# Altium project LTC_4CH.PrjPcb
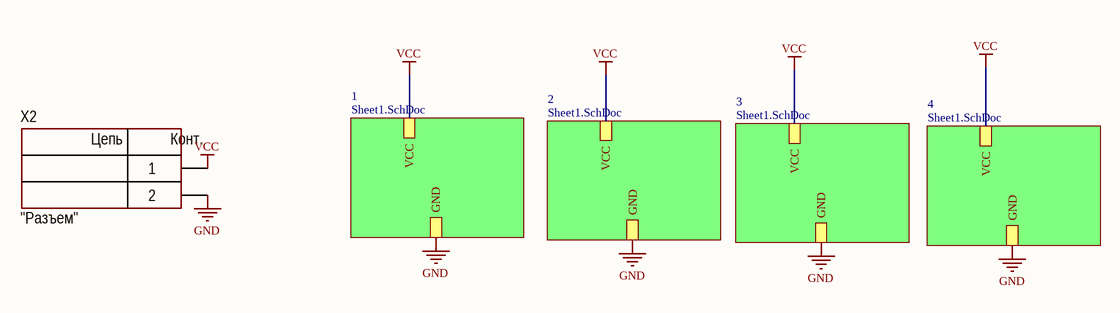
[diagram p0: Sheet2.SchDoc]
2 sheets, 57 parts. Net scope: hierarchical (ports join the sheet entries above them; power ports are global).
Board file: PCB1.PcbDoc
Sheets:
  Sheet2.SchDoc
    1 = Sheet1.SchDoc
    2 = Sheet1.SchDoc
    3 = Sheet1.SchDoc
    4 = Sheet1.SchDoc

## Sheet Sheet2.SchDoc
size 420 x 297 mm; Address1: Address1; Address2: Address2; Address3: Address3; Address4: Address4; DocumentNumber: АБВГ.123456.001 Э3; SheetNumber: 1; Scale: 1:1; DocumentType: Схема электрическая принципиальная; FirstReferrence: АБВГ.123456.001

### Parts
X2  CommentText: "Разъем"  [CON: KF301-5.0-2P]

### Sub-sheets
1 = Sheet1.SchDoc: GND, VCC
2 = Sheet1.SchDoc: GND, VCC
3 = Sheet1.SchDoc: GND, VCC
4 = Sheet1.SchDoc: GND, VCC

### Nets
GND: X2.2 ; sheet 1/GND, sheet 2/GND, sheet 3/GND, sheet 4/GND
VCC: X2.1 ; sheet 1/VCC, sheet 2/VCC, sheet 3/VCC, sheet 4/VCC

### Notes on the sheet
- Перв. примен.
- Справ. №
- Подп. и дата
- Инв. № дубл.
- Взам. инв. №
- Разраб.
- Изм.
- Лист
- № докум.
- Подп.
- Дата
- Лит.
- Масса
- Масштаб
- Пров.
- Т.контр.
- Листов
- Инв. № подл.
- Утв.
- Н.контр.
- 2.106-A3
- Копировал
- Формат А3
- (in symbol Connector_terminal_2pin) Цепь; Конт.

### Library data of the parts
X2 = Connector_terminal_2pin: Manufacturer: Degson; ValueManufacturerPartNumber: Terminal connector, 2pin, 3.5mm, 300VAC, 10A; PartNumber: DG350-3.5-02P-14; TypeConnector: Terminal connector; VoltageMax: 300VAC; Pitch: 3.5mm; CurrentMax: 10A; Multichannel: 2pin; HelpURL: https://www.chipdip.ru/product/dg350-3.5-02p-12

## Sheet Sheet1.SchDoc
size 420 x 297 mm; Address1: Address1; Address2: Address2; Address3: Address3; Address4: Address4; DocumentNumber: АБВГ.123456.001 Э3; SheetNumber: 1; Scale: 1:1; DocumentType: Схема электрическая принципиальная; FirstReferrence: АБВГ.123456.001
Used 4 times, as channels 1, 2, 3, 4. Parts and nets are listed once, with the designators drawn on the sheet.
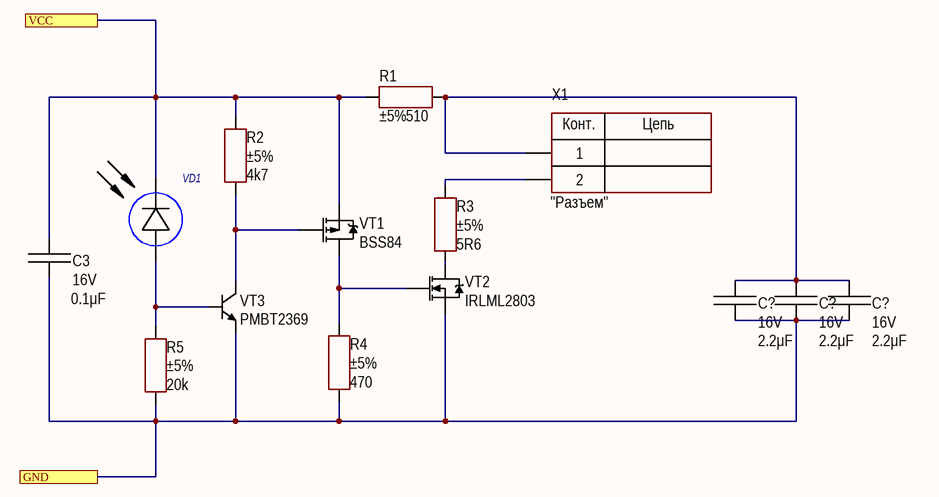
[diagram p1: Sheet1.SchDoc]

### Parts
(Parts that share a designator on the sheet are numbered #1, #2 ... from top to bottom, then left to right.)
C3  value 0.1μF  Voltage: 16V  [CAP: 0805]
C?#1  value 2.2μF  Voltage: 16V  [CAP: 1206]
C?#2  value 2.2μF  Voltage: 16V  [CAP: 1206]
C?#3  value 2.2μF  Voltage: 16V  [CAP: 1206]
R1  value 510  Tolerance: ±5%  [RES: 0805]
R2  value 4k7  Tolerance: ±5%  [RES: 0805]
R3  value 5R6  Tolerance: ±5%  [RES: 1206]
R4  value 470  Tolerance: ±5%  [RES: 0805]
R5  value 20k  Tolerance: ±5%  [RES: 0805]
VD1  SHF250  [LED: SFH757]  (value not drawn)
VT1  PartNumber: BSS84  [SOT23]
VT2  PartNumber: IRLML2803  [SOT23]
VT3  PartNumber: PMBT2369  [SOT23]
X1  CommentText: "Разъем"  [CON: KF301-5.0-2P]

### Ports
GND, VCC

### Nets
GND: C3.1 C?#1.1 C?#2.1 C?#3.1 R4.1 R5.1 VT2.2(S) VT3.2(E) ; port GND
VCC: C3.2 R1.2 R2.2 VD1.2(C) VT1.2(S) ; port VCC
NetC?#1_2: C?#1.2 C?#2.2 C?#3.2 R1.1 X1.1
NetR2_1: R2.1 VT1.1(G) VT3.3(C)
NetR3_1: R3.1 VT2.3(D)
NetR3_2: R3.2 X1.2
NetR4_2: R4.2 VT1.3(D) VT2.1(G)
NetR5_2: R5.2 VD1.1(A) VT3.1(B)

### Channels
1: designators C3=C3_1 C?=C?_1#1 C?=C?_1#2 C?=C?_1#3 R1=R1_1 R2=R2_1 R3=R3_1 R4=R4_1 R5=R5_1 VD1=VD1_1 VT1=VT1_1 VT2=VT2_1 VT3=VT3_1 X1=X1_1; ports GND=GND VCC=VCC
2: designators C3=C3_2 C?=C?_2#1 C?=C?_2#2 C?=C?_2#3 R1=R1_2 R2=R2_2 R3=R3_2 R4=R4_2 R5=R5_2 VD1=VD1_2 VT1=VT1_2 VT2=VT2_2 VT3=VT3_2 X1=X1_2; ports GND=GND VCC=VCC
3: designators C3=C3_3 C?=C?_3#1 C?=C?_3#2 C?=C?_3#3 R1=R1_3 R2=R2_3 R3=R3_3 R4=R4_3 R5=R5_3 VD1=VD1_3 VT1=VT1_3 VT2=VT2_3 VT3=VT3_3 X1=X1_3; ports GND=GND VCC=VCC
4: designators C3=C3_4 C?=C?_4#1 C?=C?_4#2 C?=C?_4#3 R1=R1_4 R2=R2_4 R3=R3_4 R4=R4_4 R5=R5_4 VD1=VD1_4 VT1=VT1_4 VT2=VT2_4 VT3=VT3_4 X1=X1_4; ports GND=GND VCC=VCC

### Notes on the sheet
- Перв. примен.
- Справ. №
- Подп. и дата
- Инв. № дубл.
- Взам. инв. №
- Разраб.
- Изм.
- Лист
- № докум.
- Подп.
- Дата
- Лит.
- Масса
- Масштаб
- Пров.
- Т.контр.
- Листов
- Инв. № подл.
- Утв.
- Н.контр.
- 2.106-A3
- Копировал
- Формат А3
- (in symbol Connector_terminal_2pin) Конт.; Цепь

### Library data of the parts
C3 = Ceramic_0805: Manufacturer: Yageo; PartNumber: CC0805KRX7R7BB104; ValueManufacturerPartNumber: Ceramic capacitor, 0.1μF, X7R, ±10%, 16V, 0805, -55...+125°C; TypeCapacitor: Ceramic capacitor; Tolerance: ±10%; TypeDielectric: X7R; Package: 0805; HelpURL: https://www.digikey.com/product-detail/en/yageo/CC0805KRX7R7BB104/311-1142-1-ND/303052; Temperature: -55...+125°C
C?#1-C?#3 = Ceramic_1206: Manufacturer: Yageo; PartNumber: CC1206KRX7R9BB104; ValueManufacturerPartNumber: Ceramic capacitor, 2.2μF, X7R, ±10%, 16V, 1206, -55...+125°C; TypeCapacitor: Ceramic capacitor; Tolerance: ±10%; TypeDielectric: X7R; Package: 1206; HelpURL: https://www.digikey.com/product-detail/en/yageo/CC1206KRX7R9BB104/311-1179-1-ND/303089; Temperature: -55...+125°C
R1 = Resistor_0805: Manufacturer: Yageo; PartNumber: RC0805JR-07100RL; ValueManufacturerPartNumber: Resistor film, 510, ±5%, 0805, 0.125W, -55...+125°C; TypeResistor: Resistor film; Power: 0.125W; Package: 0805; HelpURL: https://www.digikey.com/product-detail/en/yageo/RC0805JR-07100RL/311-100ARCT-ND/731185; Temperature: -55...+125°C
R2 = Resistor_0805: Manufacturer: Yageo; PartNumber: RC0805JR-07100RL; ValueManufacturerPartNumber: Resistor film, 4k7, ±5%, 0805, 0.125W, -55...+125°C; TypeResistor: Resistor film; Power: 0.125W; Package: 0805; HelpURL: https://www.digikey.com/product-detail/en/yageo/RC0805JR-07100RL/311-100ARCT-ND/731185; Temperature: -55...+125°C
R3 = Resistor_1206: Manufacturer: Yageo; PartNumber: RC1206JR-07100RL; ValueManufacturerPartNumber: Resistor film, 5R6, ±5%, 1206, 0.25W, -55...+125°C; TypeResistor: Resistor film; Power: 0.25W; Package: 1206; HelpURL: https://www.digikey.com/product-detail/en/yageo/RC1206JR-07100RL/311-100ERCT-ND/732153; Temperature: -55...+125°C
R4 = Resistor_0805: Manufacturer: Yageo; PartNumber: RC0805JR-07100RL; ValueManufacturerPartNumber: Resistor film, 470, ±5%, 0805, 0.125W, -55...+125°C; TypeResistor: Resistor film; Power: 0.125W; Package: 0805; HelpURL: https://www.digikey.com/product-detail/en/yageo/RC0805JR-07100RL/311-100ARCT-ND/731185; Temperature: -55...+125°C
R5 = Resistor_0805: Manufacturer: Yageo; PartNumber: RC0805JR-07100RL; ValueManufacturerPartNumber: Resistor film, 20k, ±5%, 0805, 0.125W, -55...+125°C; TypeResistor: Resistor film; Power: 0.125W; Package: 0805; HelpURL: https://www.digikey.com/product-detail/en/yageo/RC0805JR-07100RL/311-100ARCT-ND/731185; Temperature: -55...+125°C
VT1 = MOSFET_P_132: Manufacturer: Infineon Technologies; ValueManufacturerPartNumber: MOSFET P-channel transistor, 20V, 2.6A, 2.9nC, 2.5W, 135mOhm, 220pF, SOT-23, -55...+150°C; TypeTransistor: MOSFET P-channel transistor; VoltageDS: 20V; CurrentDS: 2.6A; RDS: 135mOhm; GateCharge: 2.9nC; InputCapacitor: 220pF; MaxPower: 2.5W; Package: SOT-23; HelpURL: https://www.digikey.com/product-detail/en/infineon-technologies/IRLML2246TRPBF/IRLML2246TRPBFCT-ND/2639576; Temperature: -55...+150°C
VT2 = MOSFET_N_132: Manufacturer: Infineon Technologies; ValueManufacturerPartNumber: MOSFET N-channel transistor, 80V, 7A, 9.1nC, 2.5W, 34mOhm, 756pF, 8-TDSON, -55...+150°C; TypeTransistor: MOSFET N-channel transistor; VoltageDS: 80V; CurrentDS: 7A; RDS: 34mOhm; GateCharge: 9.1nC; InputCapacitor: 756pF; MaxPower: 2.5W; Package: 8-TDSON; HelpURL: https://www.digikey.com/product-detail/en/infineon-technologies/BSC340N08NS3GATMA1/BSC340N08NS3GATMA1TR-ND/2080655; Temperature: -55...+150°C
VT3 = BJT_NPN_132: Manufacturer: ON Semiconductor; ValueManufacturerPartNumber: NPN transistor, 45V, 100mA, 100MHz, 300mW, 0.6V, 420, SOT-23, -55...+125°C; TypeTransistor: NPN transistor; VoltageCE: 45V; CurrentCE: 100mA; VoltageSaturation: 0.6V; Frequency: 100MHz; CurrentGain: 420; MaxPower: 300mW; Package: SOT-23; HelpURL: https://www.digikey.com/product-detail/en/on-semiconductor/BC847CLT1G/BC847CLT1GOSCT-ND/917836; Temperature: -55...+125°C
X1 = Connector_terminal_2pin: as X2 on sheet Sheet2; HelpURL: https://www.chipdip.ru/product/dg350-3.5-02p-12
VD1 = SHF250: Model: *; Manufacture: *; HelpURL: *; Case: *

## Nets that join several sheets
GND: Sheet2 (X2.2), 1 (8 pins), 2 (8 pins), 3 (8 pins), 4 (8 pins)
VCC: Sheet2 (X2.1), 1 (5 pins), 2 (5 pins), 3 (5 pins), 4 (5 pins)